# EasyEDA schematic 1-Schematic_controle_ar_morpheus.json
TITLE: Sheet_1; REV: 1.0; Date: 2026-03-19; Sheet: 1/1; Drawn By: joaovfabreu3; Company: Your Company
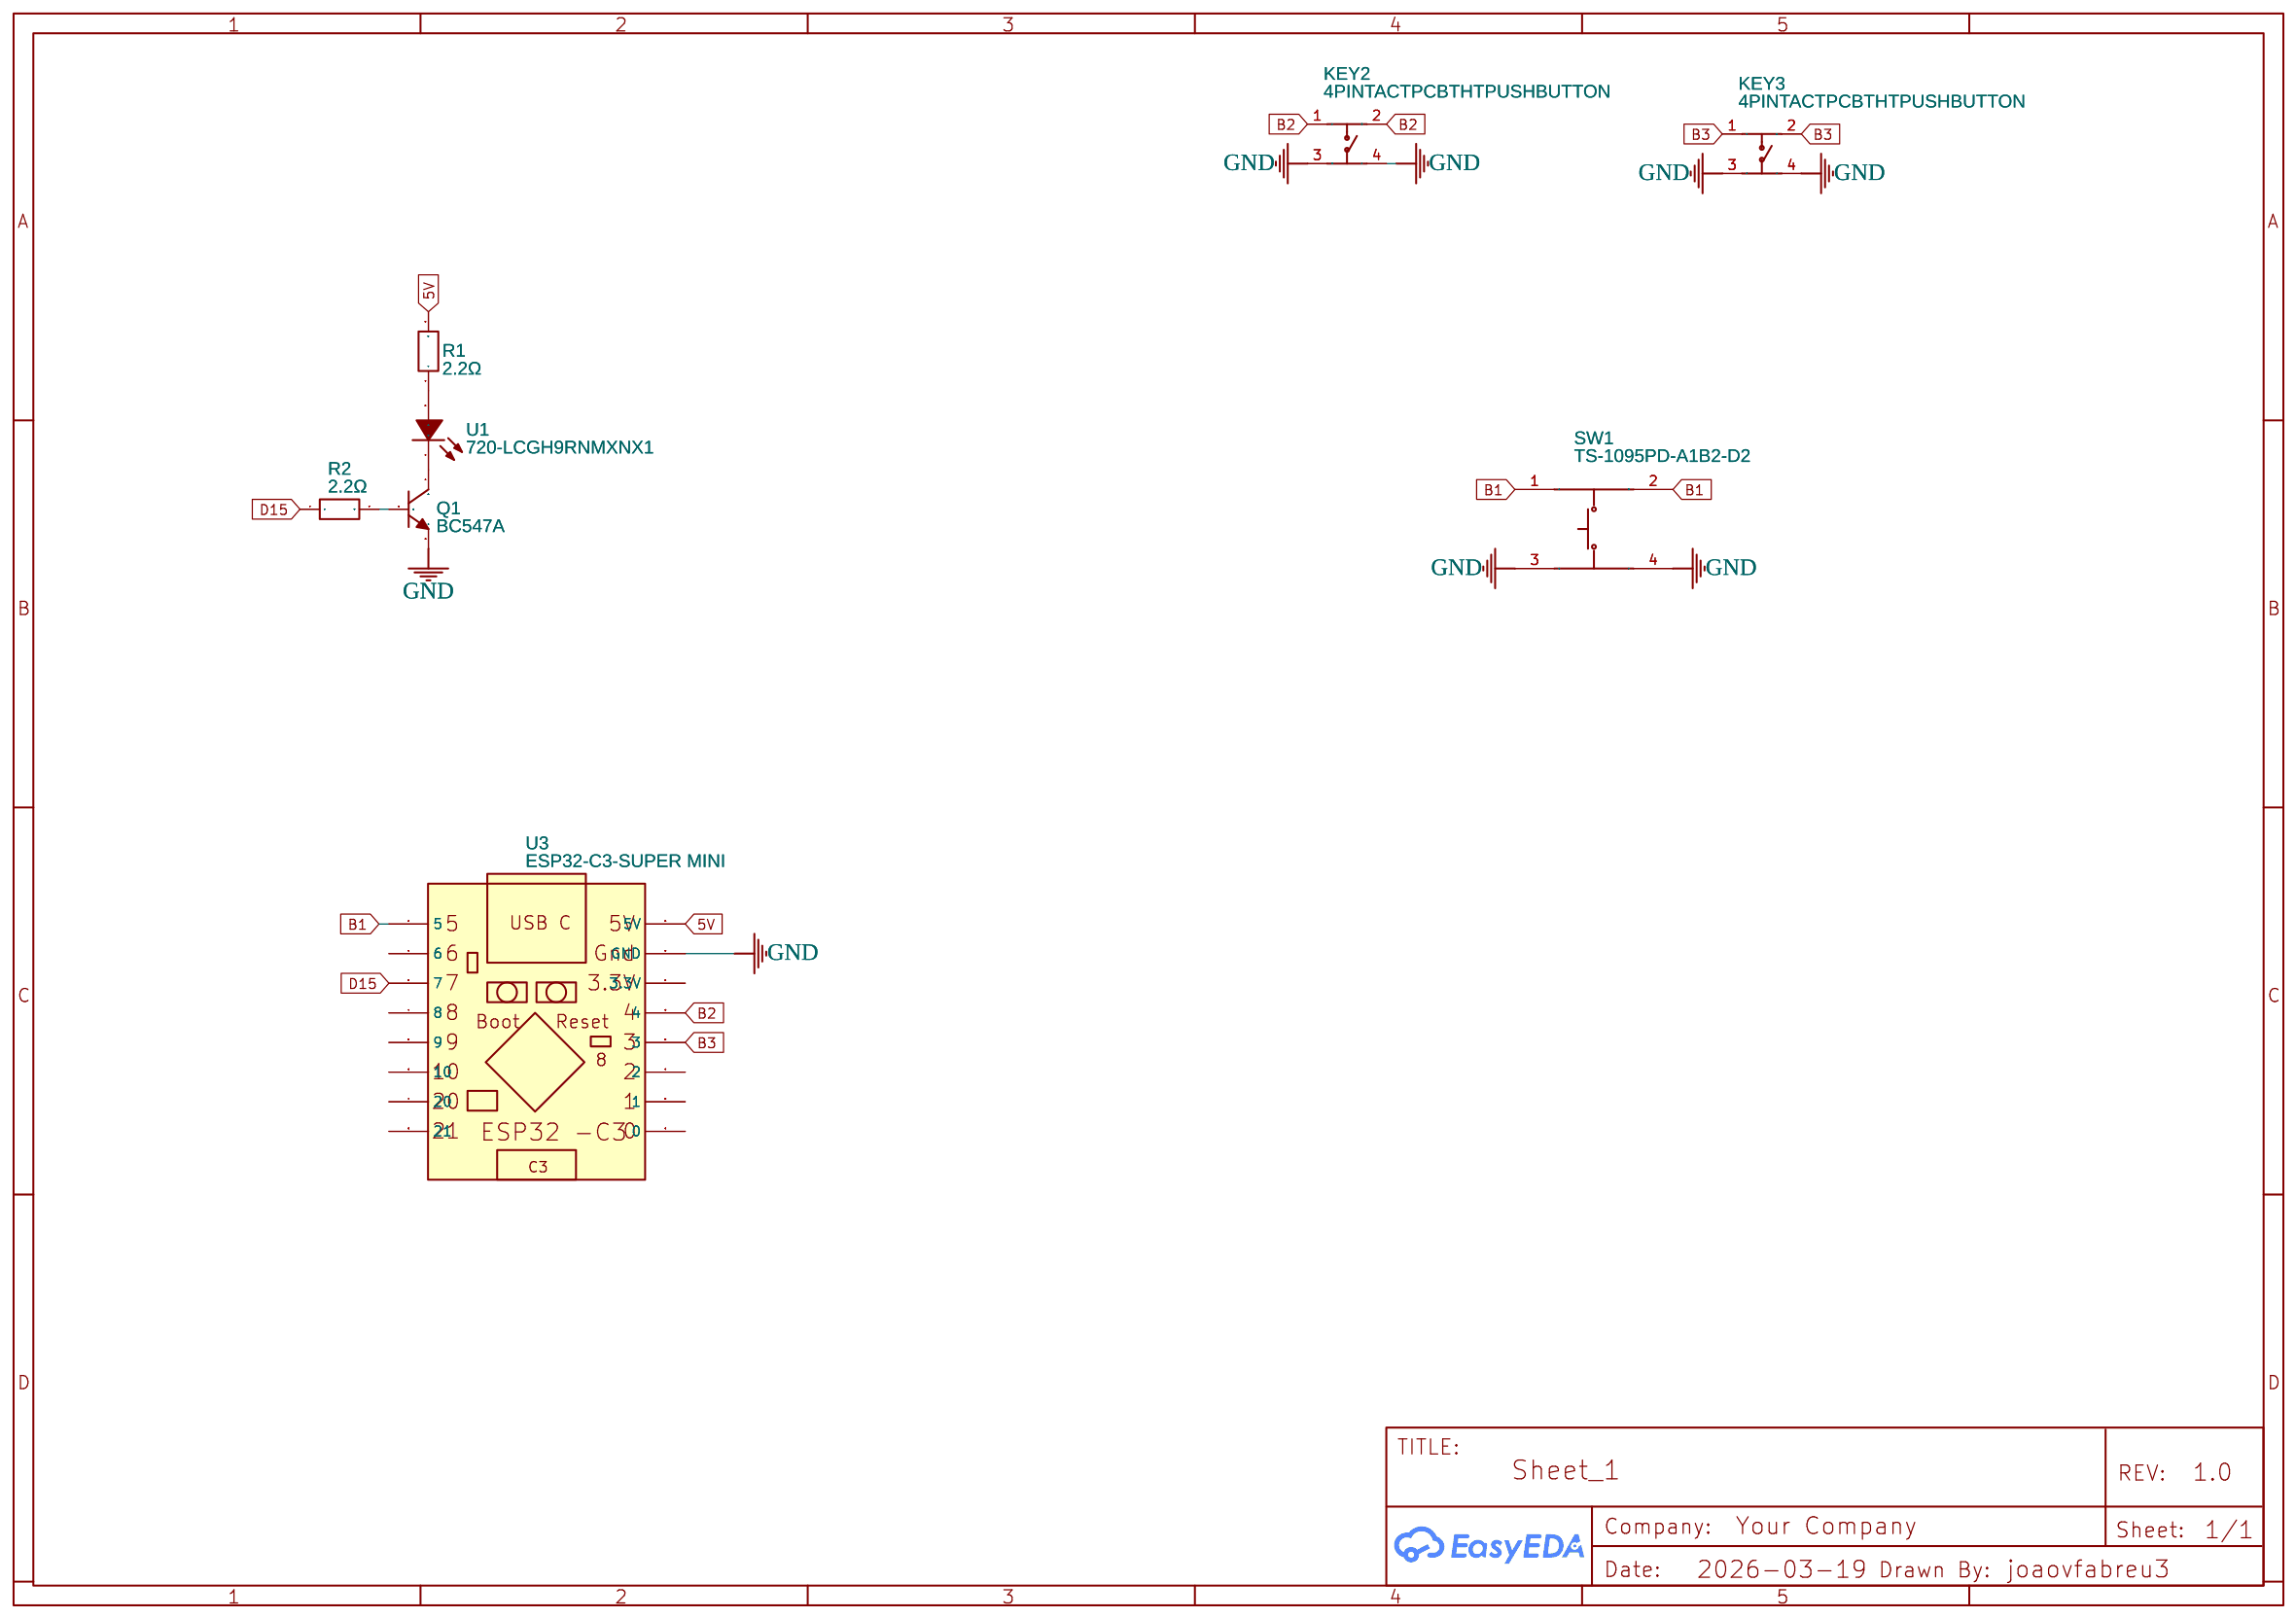
[diagram p0: schematic sheet]

## Parts
KEY2  4PINTACTPCBTHTPUSHBUTTON  [KEY-TH_4P-L6.0-W6.0-P3.90-LS6.5]
KEY3  4PINTACTPCBTHTPUSHBUTTON  [KEY-TH_4P-L6.0-W6.0-P3.90-LS6.5]
Q1  BC547A  [TO-92-3_L4.8-W3.7-P1.27-L-1]
R1  2.2Ω  [RES-6.5MMX2.2MM-MO1/4W]
R2  2.2Ω  [RES-6.5MMX2.2MM-MO1/4W]
SW1  TS-1095PD-A1B2-D2  [KEY-TH_4P-L6.0-W6.0-P3.90-LS6.5]
U1  720-LCGH9RNMXNX1  [LED-TH_LED-DP2-2LED-AMCC]
U3  ESP32-C3-SUPER MINI  [ESP32-C3-SUPERMINI]

## Library data of the parts
KEY2 KEY3 = 4PINTACTPCBTHTPUSHBUTTON: Contributor: LCSC; Supplier: LCSC; Supplier Part: C9900003768; Manufacturer: null; Manufacturer Part: 4pinTACTPCBTHTPushButton; JLCPCB Part Class: Extended Part
Q1 = BC547A: Supplier: LCSC; Supplier Part: C3201724; Manufacturer: onsemi(安森美); JLCPCB Part Class: Extended Part; Contributor: lcsc
R1 R2 = CERAMIC RESISTOR 10W/ 2,2 OHM: Supplier: LCSC; Supplier Part: C7107345; Manufacturer: Visaton; Contributor: lcsc; JLCPCB Part Class: Extended Part
SW1 = TS-1095PD-A1B2-D2: Contributor: LCSC; Supplier: LCSC; Supplier Part: C2834872; Manufacturer: Yuandi(元迪); JLCPCB Part Class: Extended Part
U1 = 720-LCGH9RNMXNX1: Contributor: lcsc; Supplier: LCSC; Supplier Part: C9900019959; Manufacturer: null; JLCPCB Part Class: Extended Part
U3 = ESP32-C3-SUPER MINI: Contributor: mplurv

## Nets
5V: R1.2 U3.16(5V)
GND: KEY2.3 KEY2.4 KEY3.3 KEY3.4 Q1.3(E) SW1.3 SW1.4 U3.15(GND)
B1: SW1.1 SW1.2 U3.1(5)
B2: KEY2.1 KEY2.2 U3.13(4)
B3: KEY3.1 KEY3.2 U3.12(3)
D15: R2.1 U3.3(7)
Net-(Q1-1): Q1.1(C) U1.1(K)
Net-(Q1-2): Q1.2(B) R2.2
Net-(R1-1): R1.1 U1.2(A)

Not connected (* = marked no-connect by the designer): U3 2(6) 4(8) 5(9) 6(10) 7(20) 8(21) 9(0) 10(1) 11(2) 14(3.3V)
